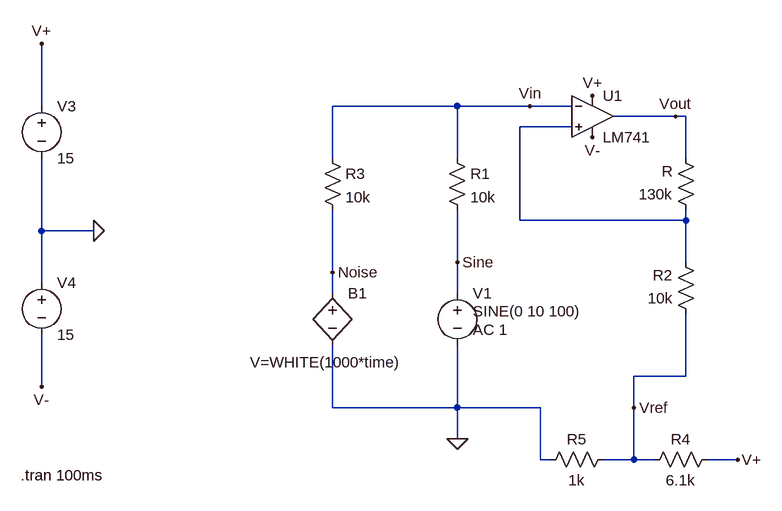
[diagram p0: schematic termprojectfinal.asc]
termprojectfinal.asc, the LTspice schematic file:
Version 4.1
SHEET 1 880 940
WIRE -976 240 -976 144
WIRE -336 240 -528 240
WIRE -224 240 -336 240
WIRE -160 240 -224 240
WIRE 0 256 -96 256
WIRE 16 256 0 256
WIRE -160 272 -240 272
WIRE -528 320 -528 240
WIRE -336 320 -336 240
WIRE 16 320 16 256
WIRE -240 416 -240 272
WIRE 16 416 16 400
WIRE 16 416 -240 416
WIRE -976 432 -976 320
WIRE -896 432 -976 432
WIRE -336 480 -336 400
WIRE 16 480 16 416
WIRE -528 496 -528 400
WIRE -976 512 -976 432
WIRE -528 528 -528 496
WIRE -336 528 -336 480
WIRE 16 656 16 560
WIRE 16 656 -64 656
WIRE -976 672 -976 592
WIRE -528 704 -528 608
WIRE -336 704 -336 608
WIRE -336 704 -528 704
WIRE -208 704 -336 704
WIRE -64 704 -64 656
WIRE -336 752 -336 704
WIRE -208 784 -208 704
WIRE -192 784 -208 784
WIRE -64 784 -64 704
WIRE -64 784 -112 784
WIRE -32 784 -64 784
WIRE 96 784 48 784
FLAG -896 432 0
FLAG -976 144 V+
FLAG -976 672 V-
FLAG -128 224 V+
FLAG -128 288 V-
FLAG 96 784 V+
FLAG -336 752 0
FLAG -64 704 Vref
FLAG 0 256 Vout
FLAG -224 240 Vin
FLAG -528 496 Noise
FLAG -336 480 Sine
SYMBOL voltage -336 512 R0
WINDOW 3 24 44 Left 2
WINDOW 123 24 72 Left 2
WINDOW 39 0 0 Left 0
SYMATTR Value SINE(0 10 100)
SYMATTR Value2 AC 1
SYMATTR InstName V1
SYMBOL res 32 416 R180
WINDOW 0 36 76 Left 2
WINDOW 3 36 40 Left 2
SYMATTR InstName R
SYMATTR Value 130k
SYMBOL res 32 576 R180
WINDOW 0 36 76 Left 2
WINDOW 3 36 40 Left 2
SYMATTR InstName R2
SYMATTR Value 10k
SYMBOL voltage -976 224 R0
WINDOW 123 0 0 Left 0
WINDOW 39 0 0 Left 0
SYMATTR InstName V3
SYMATTR Value 15
SYMBOL voltage -976 496 R0
WINDOW 123 0 0 Left 0
WINDOW 39 0 0 Left 0
SYMATTR InstName V4
SYMATTR Value 15
SYMBOL bv -528 512 R0
WINDOW 3 -127 122 Left 2
SYMATTR InstName B1
SYMATTR Value V=WHITE(1000*time)
SYMBOL res -352 304 R0
SYMATTR InstName R1
SYMATTR Value 10k
SYMBOL res -544 304 R0
SYMATTR InstName R3
SYMATTR Value 10k
SYMBOL OpAmps\\LM741 -128 192 R0
SYMATTR InstName U1
SYMBOL res -48 800 R270
WINDOW 0 32 56 VTop 2
WINDOW 3 0 56 VBottom 2
SYMATTR InstName R4
SYMATTR Value 6.1k
SYMBOL res -208 800 R270
WINDOW 0 32 56 VTop 2
WINDOW 3 0 56 VBottom 2
SYMATTR InstName R5
SYMATTR Value 1k
TEXT -1008 808 Left 2 !.tran 100ms

The netlist it stands for:
* termprojectfinal.asc
V1 Sine 0 SINE(0 10 100) AC 1
R N001 Vout 130k
R2 Vref N001 10k
V3 V+ 0 15
V4 0 V- 15
B1 Noise 0 V=WHITE(1000*time)
R1 Vin Sine 10k
R3 Vin Noise 10k
X§U1 N001 Vin V+ V- Vout LM741  ; pins In+ In- V+ V- OUT
R4 Vref V+ 6.1k
R5 0 Vref 1k
.tran 100ms
.lib LM741.lib
.backanno
.end